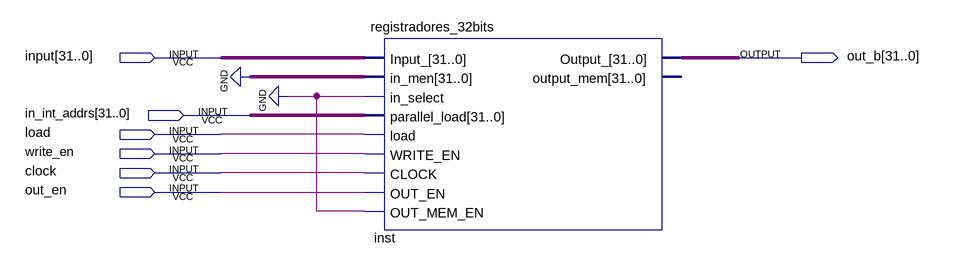
[diagram p0: schematic sheet]
// Quartus schematic LV.bdf as structural Verilog: 1 symbols, 7 pins
module LV (
  input  [31:0] \input ,
  input  [31:0] in_int_addrs,
  input  load,
  input  write_en,
  input  clock,
  input  out_en,
  output [31:0] out_b
);

  registradores_32bits inst (
    .Input_(\input ), .in_men({32{1'b0}}), .in_select(1'b0), .parallel_load(in_int_addrs), .load(load),
    .WRITE_EN(write_en), .CLOCK(clock), .OUT_EN(out_en), .OUT_MEM_EN(1'b0), .Output_(out_b));  // open: output_mem
endmodule
